# Altium schematic sheet 最终原理图.SchDoc
size A2
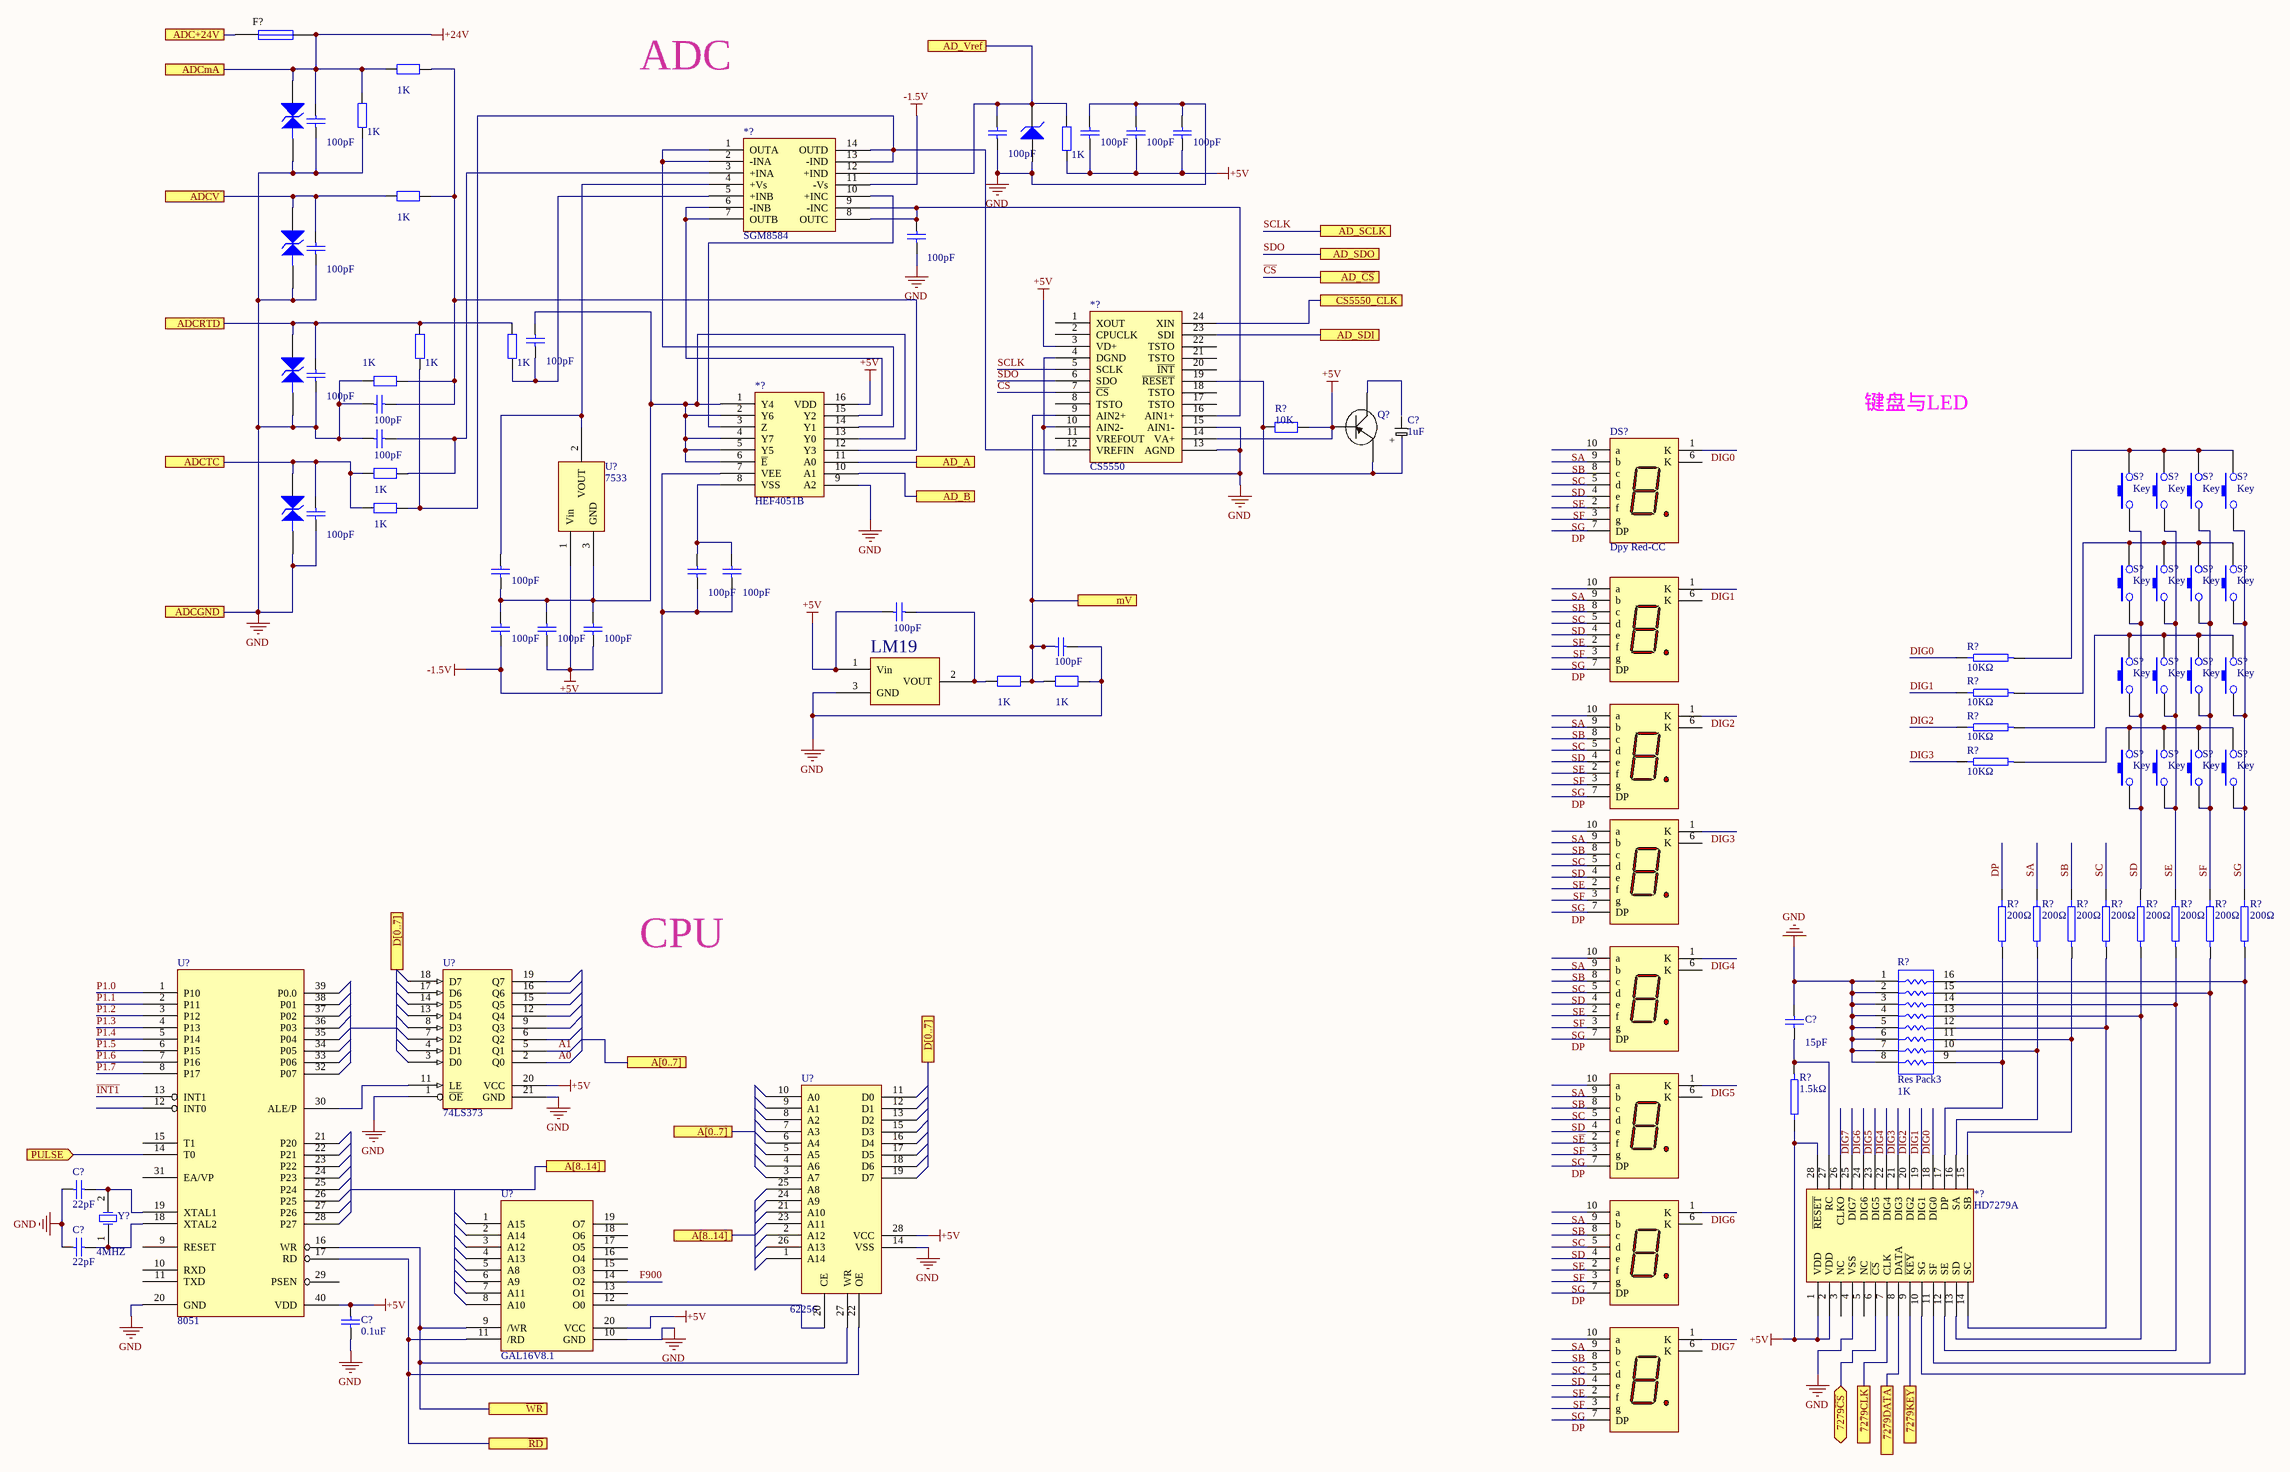
[diagram p0: 最终原理图.SchDoc]

## Parts
(Parts that share a designator on the sheet are numbered #1, #2 ... from top to bottom, then left to right.)
*?#1  ZENER3  (value not drawn)
*?#2  SGM8584
*?#3  ZENER3  (value not drawn)
*?#4  ZENER3  (value not drawn)
*?#5  CS5550
*?#6  HEF4051B
*?#7  ZENER3  (value not drawn)
*?#8  HD7279A
C?#1  value 100pF  [RAD-0.3]  (hidden comment: Cap)
C?#2  value 100pF  [RAD-0.3]  (hidden comment: Cap)
C?#3  value 100pF  [RAD-0.3]  (hidden comment: Cap)
C?#4  value 100pF  [RAD-0.3]  (hidden comment: Cap)
C?#5  value 100pF  [RAD-0.3]  (hidden comment: Cap)
C?#6  value 100pF  [RAD-0.3]  (hidden comment: Cap)
C?#7  value 100pF  [RAD-0.3]  (hidden comment: Cap)
C?#8  value 100pF  [RAD-0.3]  (hidden comment: Cap)
C?#9  value 100pF  [RAD-0.3]  (hidden comment: Cap)
C?#10  value 100pF  [RAD-0.3]  (hidden comment: Cap)
C?#11  1uF
C?#12  value 100pF  [RAD-0.3]  (hidden comment: Cap)
C?#13  value 100pF  [RAD-0.3]  (hidden comment: Cap)
C?#14  value 100pF  [RAD-0.3]  (hidden comment: Cap)
C?#15  value 100pF  [RAD-0.3]  (hidden comment: Cap)
C?#16  value 100pF  [RAD-0.3]  (hidden comment: Cap)
C?#17  value 100pF  [RAD-0.3]  (hidden comment: Cap)
C?#18  value 100pF  [RAD-0.3]  (hidden comment: Cap)
C?#19  value 100pF  [RAD-0.3]  (hidden comment: Cap)
C?#20  value 100pF  [RAD-0.3]  (hidden comment: Cap)
C?#21  value 100pF  [RAD-0.3]  (hidden comment: Cap)
C?#22  value 15pF  [RAD-0.3]
C?#23  value 22pF  [RAD-0.3]
C?#24  value 22pF  [RAD-0.3]
C?#25  value 0.1uF  [RAD-0.3]
D?  D Zener  [DIODE-0.7]  (value not drawn)
DS?#1  Dpy Red-CC  [A]
DS?#2  Dpy Red-CC  [A]  (value not drawn)
DS?#3  Dpy Red-CC  [A]  (value not drawn)
DS?#4  Dpy Red-CC  [A]  (value not drawn)
DS?#5  Dpy Red-CC  [A]  (value not drawn)
DS?#6  Dpy Red-CC  [A]  (value not drawn)
DS?#7  Dpy Red-CC  [A]  (value not drawn)
DS?#8  Dpy Red-CC  [A]  (value not drawn)
F?  12  [PIN-W2/E2.8]  (value not drawn)
Q?#1  8550  (value not drawn)
Q?#2  LM19
R?#1  value 1K  [AXIAL-0.4]  (hidden comment: Res2)
R?#2  value 1K  [AXIAL-0.4]  (hidden comment: Res2)
R?#3  value 1K  [AXIAL-0.4]  (hidden comment: Res2)
R?#4  value 1K  [AXIAL-0.4]  (hidden comment: Res2)
R?#5  value 1K  [AXIAL-0.4]  (hidden comment: Res2)
R?#6  value 1K  [AXIAL-0.4]  (hidden comment: Res2)
R?#7  value 1K  [AXIAL-0.4]  (hidden comment: Res2)
R?#8  value 10K  [AXIAL-0.4]  (hidden comment: Res2)
R?#9  value 1K  [AXIAL-0.4]  (hidden comment: Res2)
R?#10  value 1K  [AXIAL-0.4]  (hidden comment: Res2)
R?#11  10KΩ
R?#12  value 1K  [AXIAL-0.4]  (hidden comment: Res2)
R?#13  value 1K  [AXIAL-0.4]  (hidden comment: Res2)
R?#14  10KΩ
R?#15  10KΩ
R?#16  10KΩ
R?#17  200Ω
R?#18  200Ω
R?#19  200Ω
R?#20  200Ω
R?#21  200Ω
R?#22  200Ω
R?#23  200Ω
R?#24  200Ω
R?#25  Res Pack3  value 1K  [SO-16_N]
R?#26  1.5kΩ
S?#1  Key
S?#2  Key
S?#3  Key
S?#4  Key
S?#5  Key
S?#6  Key
S?#7  Key
S?#8  Key
S?#9  Key
S?#10  Key
S?#11  Key
S?#12  Key
S?#13  Key
S?#14  Key
S?#15  Key
S?#16  Key
U?#1  7533
U?#2  74LS373
U?#3  62256
U?#4  8051
U?#5  GAL16V8.1
Y?  4MHZ  [crystals]

## Ports
7279CLK, 7279DATA, 7279~{CS} (bidir), 7279~{KEY}, A[0..7], A[8..14], AD_A, AD_B, AD_SCLK, AD_SDI, AD_SDO, AD_Vref, AD_~{CS}, ADC+24V, ADCGND, ADCmA, ADCRTD, ADCTC, ADCV, CS5550_CLK, D[0..7], mV, PULSE (in), ~{RD}, ~{WR}

## Nets
+5V: *?#5.3(VD+) *?#5.14(VA+) *?#6.16(VDD) *?#8.1(VDD) *?#8.2(VDD) *?#8.28(~{RESET}) C?#3.1 C?#4.1 C?#5.1 C?#17.1 C?#19.1 C?#20.1 C?#25.1 Q?#1.7 Q?#2.1(Vin) R?#3.1 R?#8.2 R?#26.2 U?#1.1(Vin) U?#2.20(VCC) U?#3.28(VCC) U?#4.40(VDD) U?#5.20(VCC)
+24V: *?#1.2(K) C?#1.2 F?.2 R?#1.1 R?#2.2 ; port ADCmA
-1.5V: *?#2.11(-Vs) *?#6.7(VEE) C?#15.1 C?#16.1 C?#18.1
GND: *?#1.1(A) *?#3.1(A) *?#4.1(A) *?#5.4(DGND) *?#5.10(AIN2-) *?#5.13(AGND) *?#5.15(AIN1-) *?#6.9(A2) *?#7.1(A) *?#8.4(VSS) C?#1.1 C?#2.1 C?#3.2 C?#4.2 C?#5.2 C?#6.1 C?#7.1 C?#9.1 C?#10.1 C?#12.1 C?#13.1 C?#21.1 C?#22.1 C?#23.2 C?#24.2 C?#25.2 D?.1(A) Q?#2.3(GND) R?#2.1 R?#7.1 R?#13.2 R?#25.1 R?#25.2 R?#25.3 R?#25.4 R?#25.5 R?#25.6 R?#25.7 R?#25.8 U?#2.1(~{OE}) U?#2.21(GND) U?#3.14(VSS) U?#4.20(GND) U?#5.10(GND) ; port ADCGND
7279~{CS}: *?#8.6(~{CS}) ; port 7279~{CS}
7279CLK: *?#8.7(CLK) ; port 7279CLK
7279DATA: *?#8.8(DATA) ; port 7279DATA
7279~{KEY}: *?#8.9(~{KEY}) ; port 7279~{KEY}
A0: U?#2.2(Q0)
A1: U?#2.5(Q1)
AD_A: *?#6.11(A0) ; port AD_A
AD_B: *?#6.10(A1) ; port AD_B
AD_SDI: *?#5.23(SDI) ; port AD_SDI
AD_Vref: *?#2.12(+IND) C?#2.2 D?.2(K) R?#3.2 ; port AD_Vref
ADC+24V: F?.1 ; port ADC+24V
ADCRTD: *?#4.2(K) C?#9.2 R?#5.1 R?#6.2 ; port ADCRTD
ADCTC: *?#7.2(K) C?#13.2 R?#9.1 R?#10.1 ; port ADCTC
ADCV: *?#3.2(K) C?#7.2 R?#4.1 ; port ADCV
~{CS}: *?#5.7(~{CS}) ; port AD_~{CS}
CS5550_CLK: *?#5.24(XIN) ; port CS5550_CLK
DIG0: *?#8.18(DIG0) DS?#1.1(K) R?#11.2
DIG1: *?#8.19(DIG1) DS?#2.1(K) R?#14.2
DIG2: *?#8.20(DIG2) DS?#3.1(K) R?#15.2
DIG3: *?#8.21(DIG3) DS?#4.1(K) R?#16.2
DIG4: *?#8.22(DIG4) DS?#5.1(K)
DIG5: *?#8.23(DIG5) DS?#6.1(K)
DIG6: *?#8.24(DIG6) DS?#7.1(K)
DIG7: *?#8.25(DIG7) DS?#8.1(K)
DP: DS?#1.7(DP) DS?#2.7(DP) DS?#3.7(DP) DS?#4.7(DP) DS?#5.7(DP) DS?#6.7(DP) DS?#7.7(DP) DS?#8.7(DP) R?#17.2
F900: U?#5.14(O2)
~{INT1}: U?#4.13(INT1)
mV: *?#5.9(AIN2+) C?#21.2 R?#12.2 R?#13.1 ; port mV
P1.0: U?#4.1(P10)
P1.1: U?#4.2(P11)
P1.2: U?#4.3(P12)
P1.3: U?#4.4(P13)
P1.4: U?#4.5(P14)
P1.5: U?#4.6(P15)
P1.6: U?#4.7(P16)
P1.7: U?#4.8(P17)
PULSE: U?#4.14(T0) ; port PULSE
~{RD}: U?#3.22(OE) U?#4.17(RD) U?#5.11(/RD) ; port ~{RD}
SA: DS?#1.10(a) DS?#2.10(a) DS?#3.10(a) DS?#4.10(a) DS?#5.10(a) DS?#6.10(a) DS?#7.10(a) DS?#8.10(a) R?#18.2
SB: DS?#1.9(b) DS?#2.9(b) DS?#3.9(b) DS?#4.9(b) DS?#5.9(b) DS?#6.9(b) DS?#7.9(b) DS?#8.9(b) R?#19.2
SC: DS?#1.8(c) DS?#2.8(c) DS?#3.8(c) DS?#4.8(c) DS?#5.8(c) DS?#6.8(c) DS?#7.8(c) DS?#8.8(c) R?#20.2
SCLK: *?#5.5(SCLK) ; port AD_SCLK
SD: DS?#1.5(d) DS?#2.5(d) DS?#3.5(d) DS?#4.5(d) DS?#5.5(d) DS?#6.5(d) DS?#7.5(d) DS?#8.5(d) R?#21.2 S?#1.1 S?#5.1 S?#9.1 S?#13.1
SDO: *?#5.6(SDO) ; port AD_SDO
SE: DS?#1.4(e) DS?#2.4(e) DS?#3.4(e) DS?#4.4(e) DS?#5.4(e) DS?#7.4(e) DS?#8.4(e) R?#22.2 S?#2.1 S?#6.1 S?#10.1 S?#14.1
S~{E}: DS?#6.4(e)
SF: DS?#1.2(f) DS?#2.2(f) DS?#3.2(f) DS?#4.2(f) DS?#5.2(f) DS?#6.2(f) DS?#7.2(f) DS?#8.2(f) R?#23.2 S?#3.1 S?#7.1 S?#11.1 S?#15.1
SG: DS?#1.3(g) DS?#2.3(g) DS?#3.3(g) DS?#4.3(g) DS?#5.3(g) DS?#6.3(g) DS?#7.3(g) DS?#8.3(g) R?#24.2 S?#4.1 S?#8.1 S?#12.1 S?#16.1
~{WR}: U?#3.27(WR) U?#4.16(WR) U?#5.9(/WR) ; port ~{WR}
Net*?#2_1: *?#2.1(OUTA) *?#2.2(-INA) *?#6.14(Y1)
Net*?#2_3: *?#2.3(+INA) C?#12.2 R?#9.2
Net*?#2_4: *?#2.4(+Vs) C?#14.2 U?#1.2(VOUT)
Net*?#2_5: *?#2.5(+INB) C?#8.1 R?#6.1
Net*?#2_6: *?#2.6(-INB) *?#2.7(OUTB) *?#6.15(Y2)
Net*?#2_8: *?#2.8(OUTC) *?#2.9(-INC) *?#5.16(AIN1+) C?#6.2
Net*?#2_10: *?#2.10(+INC) *?#6.3(Z)
Net*?#2_13: *?#2.13(-IND) *?#2.14(OUTD) *?#5.12(VREFIN) R?#5.2 R?#10.2
Net*?#5_19: *?#5.19(~{RESET}) Q?#1.8 R?#8.1
Net*?#6_1: *?#6.1(Y4) *?#6.2(Y6) *?#6.4(Y7) *?#6.5(Y5) *?#6.6(~{E}) *?#6.13(Y0) C?#8.2 C?#14.1 C?#18.2 C?#19.2 C?#20.2 U?#1.3(GND)
Net*?#6_8: *?#6.8(VSS) C?#15.2 C?#16.2
Net*?#6_12: *?#6.12(Y3) C?#10.2 R?#1.2 R?#4.2 R?#7.2
Net*?#8_10: *?#8.10(SG) R?#24.1 R?#25.16
Net*?#8_11: *?#8.11(SF) R?#23.1 R?#25.15
Net*?#8_12: *?#8.12(SE) R?#22.1 R?#25.14
Net*?#8_13: *?#8.13(SD) R?#21.1 R?#25.13
Net*?#8_14: *?#8.14(SC) R?#20.1 R?#25.12
Net*?#8_15: *?#8.15(SB) R?#19.1 R?#25.11
Net*?#8_16: *?#8.16(SA) R?#18.1 R?#25.10
Net*?#8_17: *?#8.17(DP) R?#17.1 R?#25.9
Net*?#8_27: *?#8.27(RC) C?#22.2 R?#26.1
NetC?#17_2: C?#17.2 Q?#2.2(VOUT) R?#12.1
NetC?#23_1: C?#23.1 U?#4.19(XTAL1) Y?.2(OSC2)
NetC?#24_1: C?#24.1 U?#4.18(XTAL2) Y?.1(OSC1)
NetR?#11_1: R?#11.1 S?#1.2 S?#2.2 S?#3.2 S?#4.2
NetR?#14_1: R?#14.1 S?#5.2 S?#6.2 S?#7.2 S?#8.2
NetR?#15_1: R?#15.1 S?#9.2 S?#10.2 S?#11.2 S?#12.2
NetR?#16_1: R?#16.1 S?#13.2 S?#14.2 S?#15.2 S?#16.2
NetU?#2_11: U?#2.11(LE) U?#4.30(ALE/P)
NetU?#3_20: U?#3.20(CE) U?#5.12(O0)

Not connected (* = marked no-connect by the designer): *?#5 1(XOUT) 2(CPUCLK) 8(TSTO) 11(VREFOUT) 17(TSTO) 18(TSTO) 20(~{INT}) 21(TSTO) 22(TSTO); *?#8 3(NC) 5(NC) 26(CLKO); DS?#1 6(K); DS?#2 6(K); DS?#3 6(K); DS?#4 6(K); DS?#5 6(K); DS?#6 6(K); DS?#7 6(K); DS?#8 6(K); Q?#1 9; U?#2 3(D0) 4(D1) 6(Q2) 7(D2) 8(D3) 9(Q3) 12(Q4) 13(D4) 14(D5) 15(Q5) 16(Q6) 17(D6) 18(D7) 19(Q7); U?#3 1(A14) 2(A12) 3(A7) 4(A6) 5(A5) 6(A4) 7(A3) 8(A2) 9(A1) 10(A0) 11(D0) 12(D1) 13(D2) 15(D3) 16(D4) 17(D5) 18(D6) 19(D7) 21(A10) 23(A11) 24(A9) 25(A8) 26(A13); U?#4 9(RESET) 10(RXD) 11(TXD) 12(INT0) 15(T1) 21(P20) 22(P21) 23(P22) 24(P23) 25(P24) 26(P25) 27(P26) 28(P27) 29(PSEN) 31(EA/VP) 32(P07) 33(P06) 34(P05) 35(P04) 36(P03) 37(P02) 38(P01) 39(P0.0); U?#5 1(A15) 2(A14) 3(A12) 4(A13) 5(A8) 6(A9) 7(A11) 8(A10) 13(O1) 15(O3) 16(O4) 17(O5) 18(O6) 19(O7)

## Notes on the sheet
- ADC
- 键盘与LED
- CPU
- (in symbol Component_1) +

## Library data of the parts
C?#1-C?#10 C?#12-C?#25 = Cap: Capacitor; Published: 8-Jun-2000; LatestRevisionDate: 17-Jul-2002; LatestRevisionNote: Re-released for DXP Platform.; PackageReference: RAD-0.3; Publisher: Altium Limited
  C?#1-C?#10 C?#12-C?#21: PackageDescription: Radial Cap, Thru-Hole; 2 Leads; 0.3 in Pin Spacing
C?#11 Q?#2 U?#1 = Component_1
D? = D Zener: Zener Diode; Published: 8-Jun-2000; LatestRevisionDate: 17-Jul-2002; LatestRevisionNote: Re-released for DXP Platform.; PackageReference: DIODE-0.7; Publisher: Altium Limited; PackageDescription: Diode, Thru-Hole; 2 Leads; 0.7 in Pin Spacing
DS?#1-DS?#8 = Dpy Red-CC: 7.62 mm Black Surface HER 7-Segment Display: CC, RH DP; MinimumIntensity: 360 ucd; Note: IF = 5 mA; Colour: High Efficiency Red (HER); Note: Pins 1 and 6 are redundant Cathodes.; Published: 8-Jun-2000; LatestRevisionDate: 17-Dec-2003; LatestRevisionNote: Schematic revised, PCB Footprint replaced.; DatasheetVersion: 19-Feb-2002; PackageVersion: 11-Feb-2002; PackageReference: A; Publisher: Altium Limited; PackageDescription: LED, 7-Segment Display, 7.62 mm, RHD; 10 Leads; Row Space 5.08 mm; Pitch 2.54 mm; ComponentLink1Description: Manufacturer Link; ComponentLink1URL: http://www.agilent.com/
F? = Fuse 1: Fuse; Published: 8-Jun-2000; LatestRevisionDate: 17-Jul-2002; LatestRevisionNote: Re-released for DXP Platform.; PackageReference: PIN-W2/E2.8; Publisher: Altium Limited; PackageDescription: Thru-Hole; 2 Leads
R?#1-R?#10 R?#12 R?#13 = Res2: Resistor; Published: 8-Jun-2000; LatestRevisionDate: 17-Jul-2002; LatestRevisionNote: Re-released for DXP Platform.; PackageReference: AXIAL-0.4; Publisher: Altium Limited
  R?#1-R?#7 R?#9 R?#10 R?#12 R?#13: PackageDescription: Axial Device, Thru-Hole; 2 Leads; 0.4 in Pin Spacing
R?#11 R?#14-R?#24 R?#26 = 电阻
R?#25 = Res Pack3: Isolated Resistor Network; Published: 24-Mar-1999; LatestRevisionDate: 29-May-2009; LatestRevisionNote: IPC-7351 Footprint Added.; PackageReference: SO-16; Publisher: Altium Limited; PackageDescription: 16-Pin Small Outline Integrated Circuit 1.27 mm Pitch; Code_JEDEC: MS-012-AC; Code_IPC: SOIC127P600-16
Y? = XTAL: Crystal Oscillator; Published: 8-Jun-2000; LatestRevisionDate: 17-Jul-2002; LatestRevisionNote: Re-released for DXP Platform.; PackageReference: R38; Publisher: Altium Limited